# Altium project H2_receiver_v3.PrjPcb
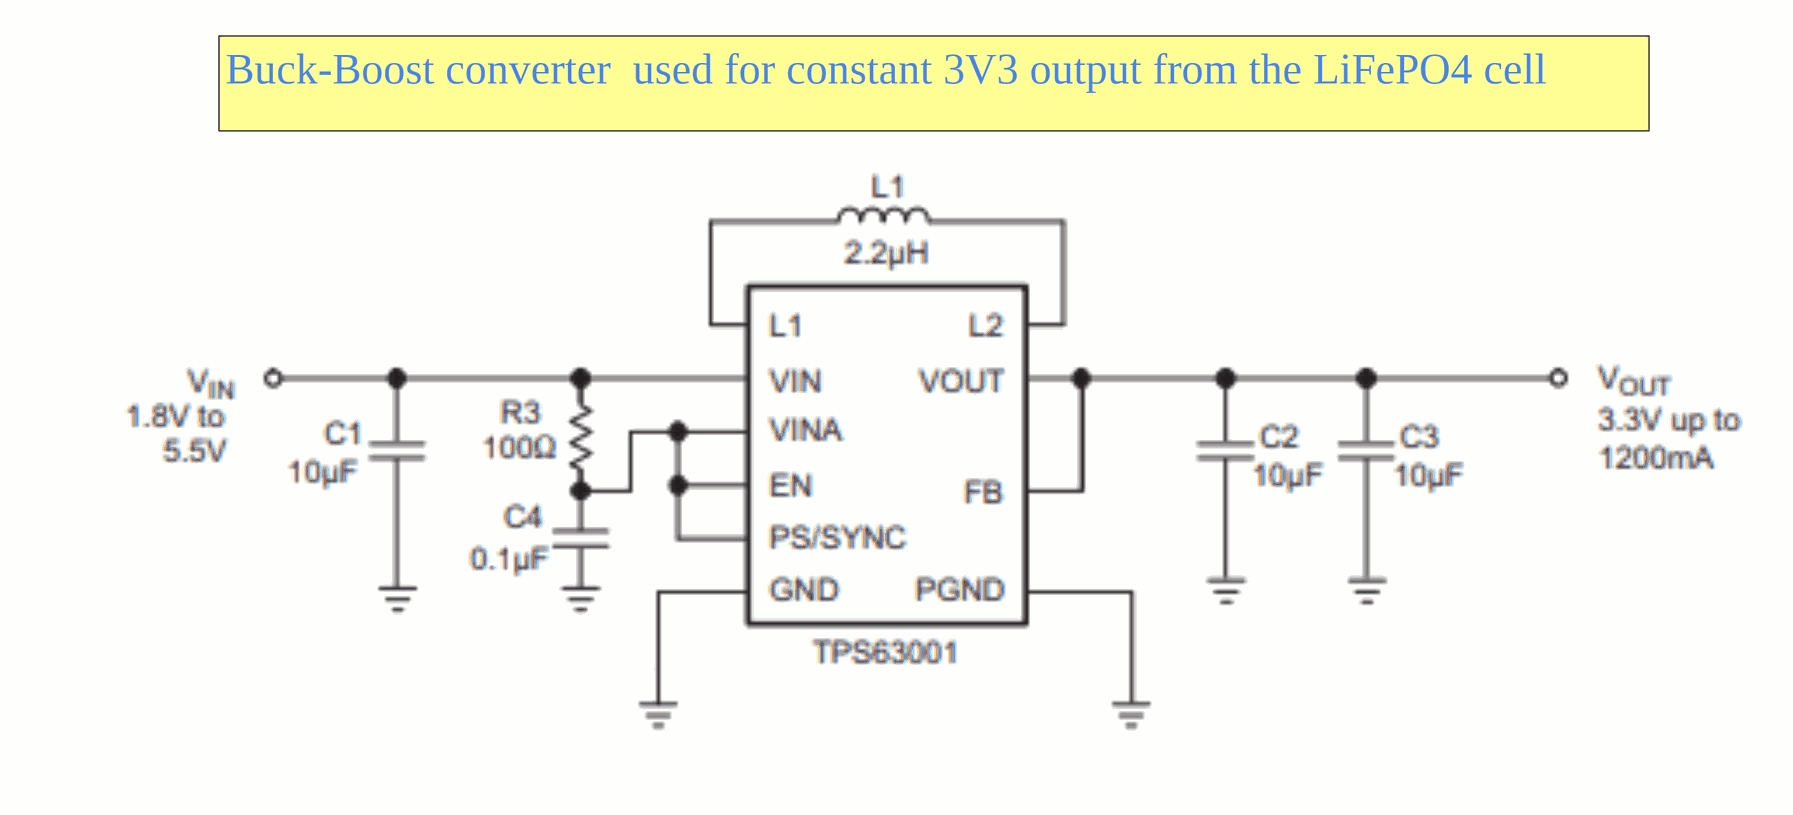
[diagram p0: 1_Power.SchDoc, top left]
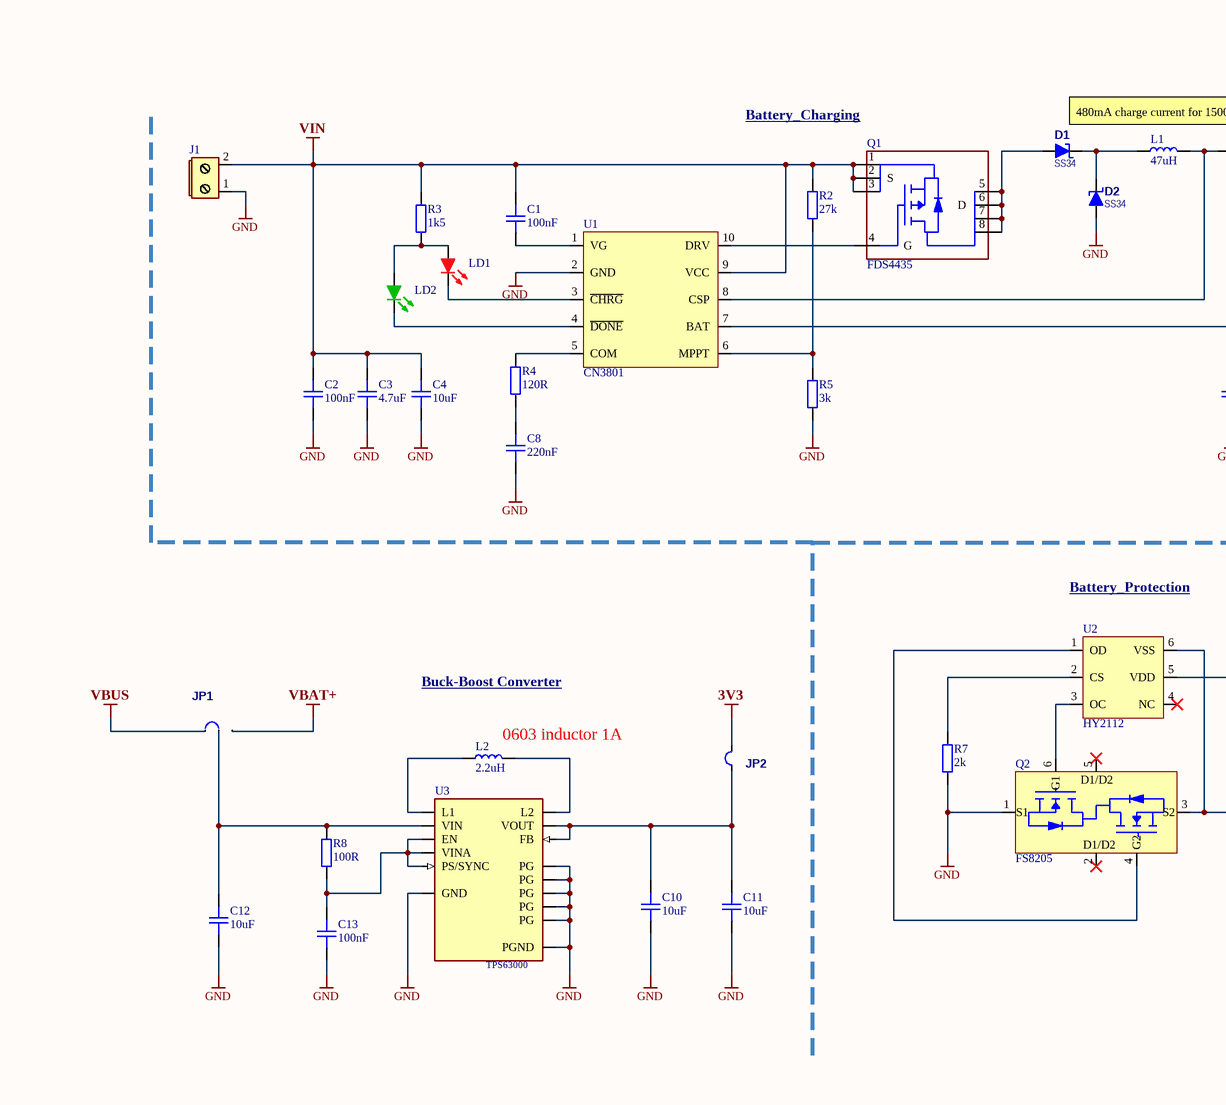
[diagram p1: 1_Power.SchDoc, top middle]
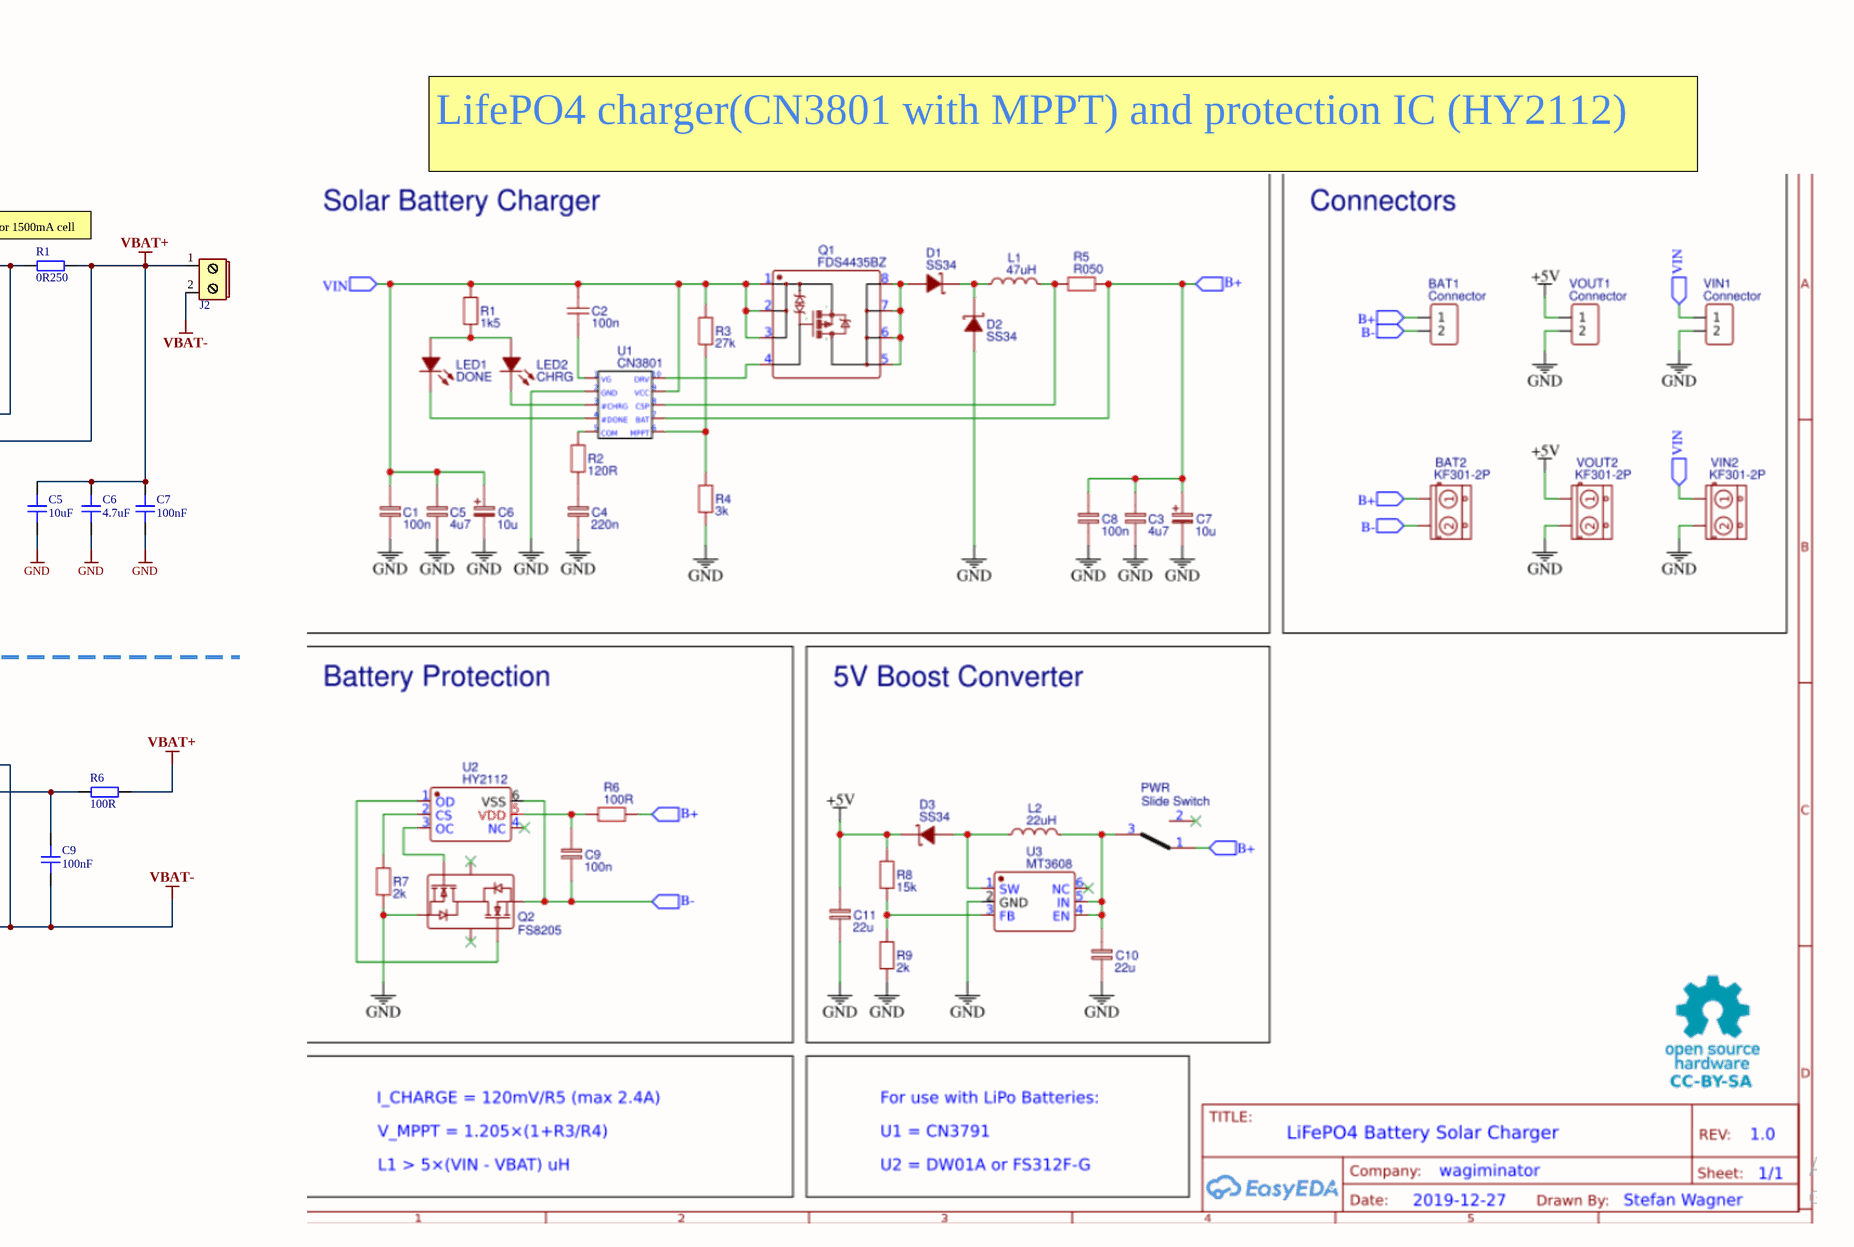
[diagram p2: 1_Power.SchDoc, top right]
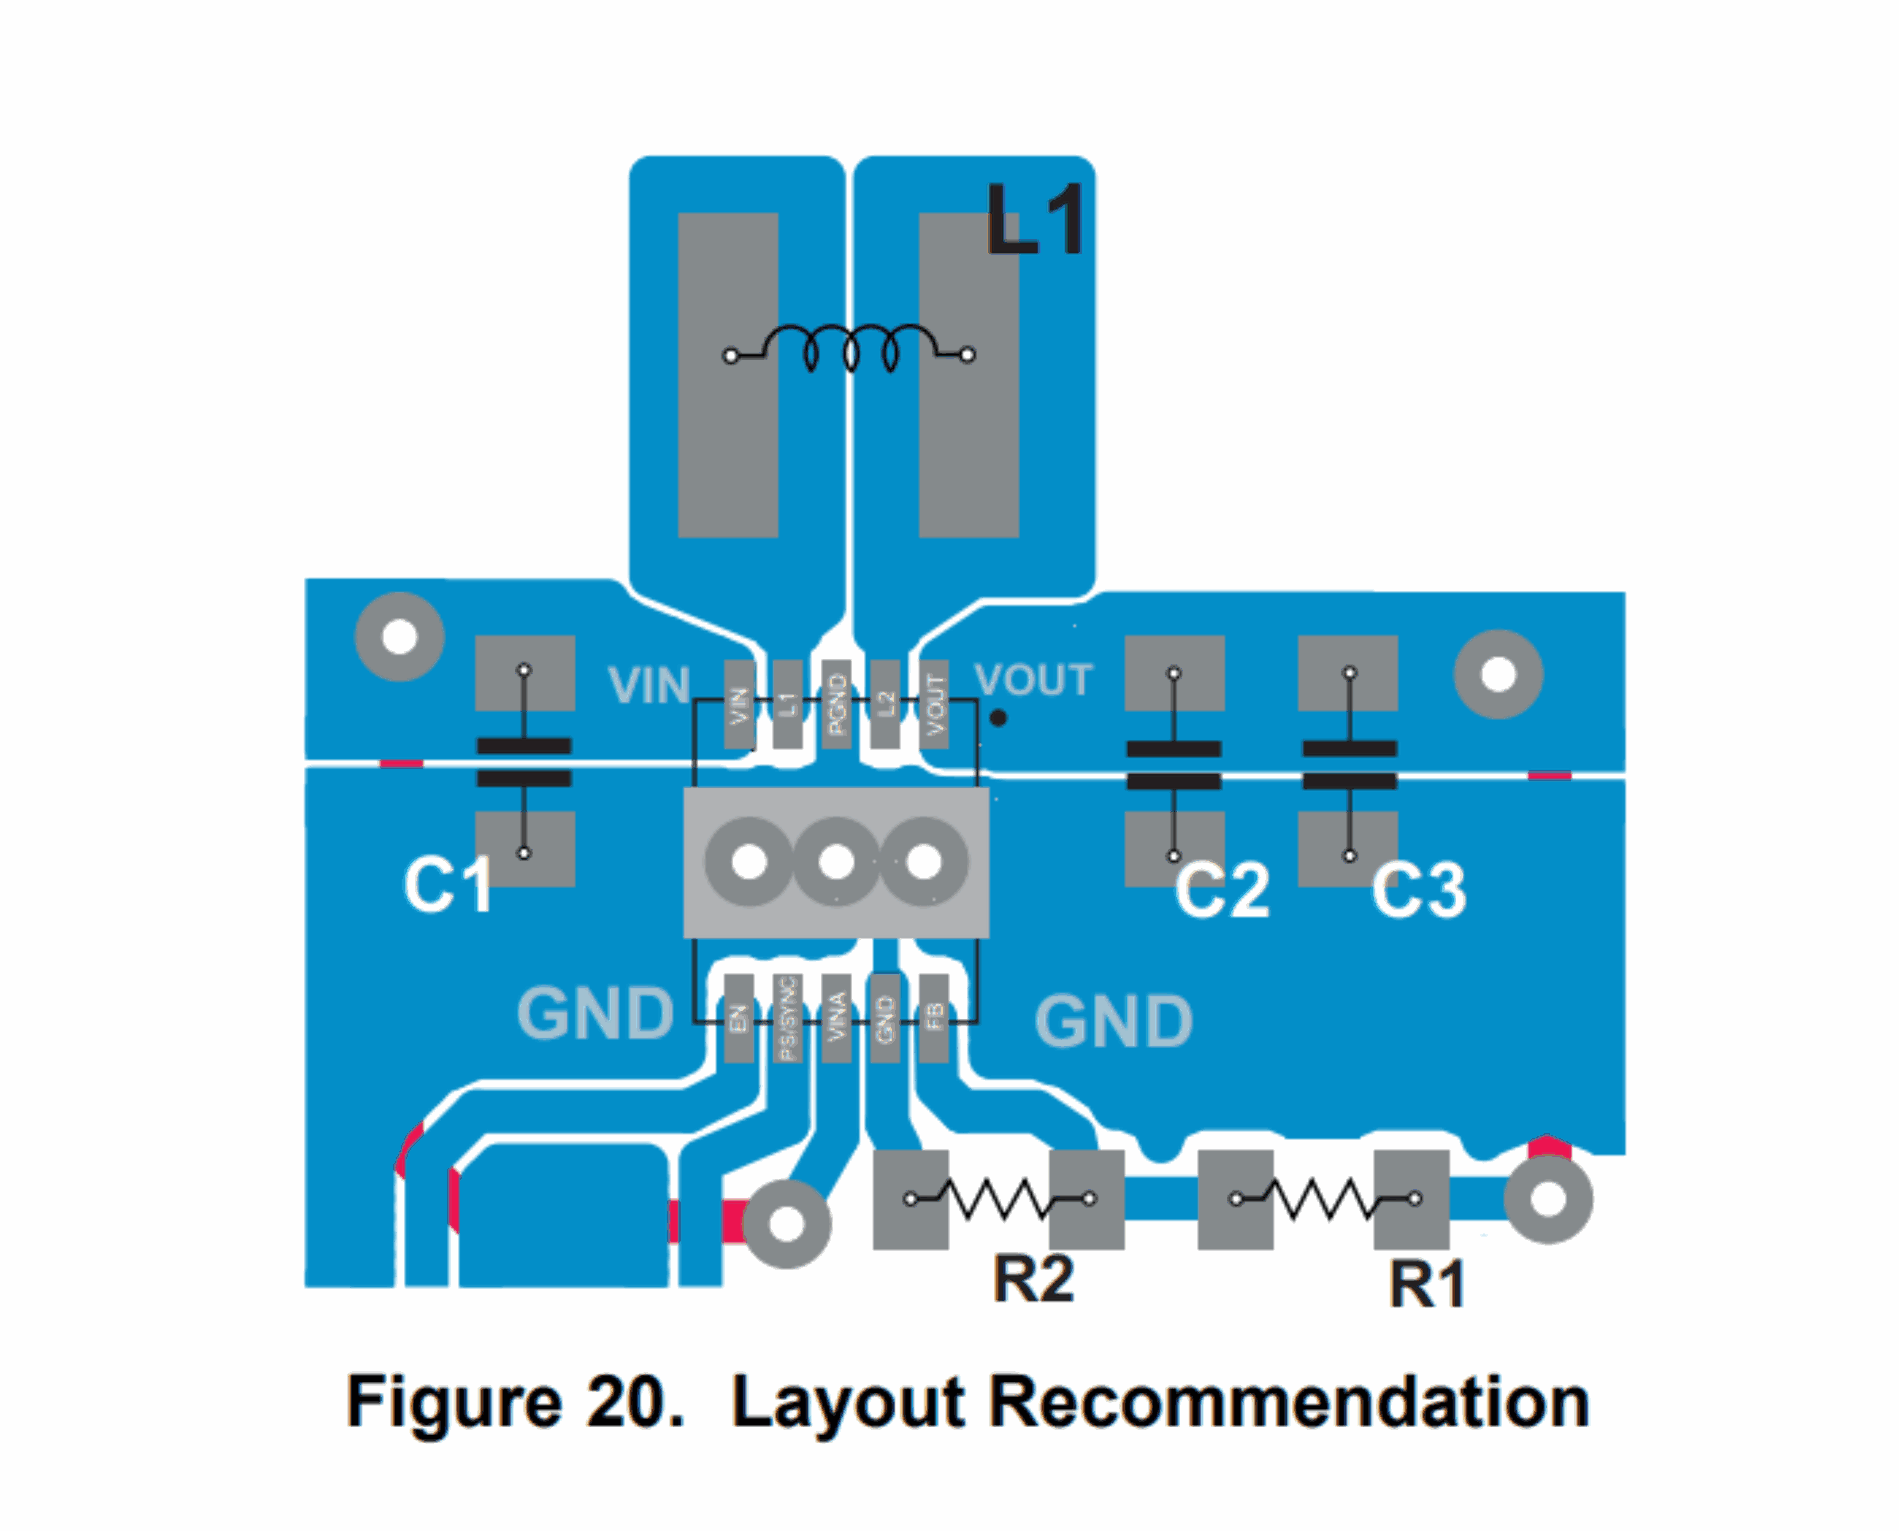
[diagram p3: 1_Power.SchDoc, bottom left]
4 sheets, 104 parts. Net scope: flat (ports and power ports of the same name join across sheets).
Board file: PCB1.PcbDoc
Sheets:
  1_Power.SchDoc
  2_Microcontroller.SchDoc
  3_Communication.SchDoc
  4_Display_NFC.SchDoc

## Sheet 1_Power.SchDoc: Power
size A4; DrawnBy: Cristian Oprea; Revision: 1; SheetNumber: 1; SheetTotal: 4

### Parts
C1  100nF  [C0603]
C2  100nF  [C0603]
C3  4.7uF  [C0603]
C4  10uF  [C0805]
C5  10uF  [C0805]
C6  4.7uF  [C0603]
C7  100nF  [C0603]
C8  220nF  [C0603]
C9  100nF  [C0603]
C10  10uF  [C0805]
C11  10uF  [C0805]
C12  10uF  [C0805]
C13  100nF  [C0603]
D1  SS34  [DO-214AC]
D2  SS34  [DO-214AC]
J1  PLUGIN_TERMINAL  [2.54_pluggable_terminal]  (value not drawn)
J2  PLUGIN_TERMINAL  [HEADER_1x2_2.54]  (value not drawn)
JP1  JUMPER_3PIN  [HEADER_1x3_2.54]  (value not drawn)
JP2  JUMPER  [HEADER_1x2_2.54]  (value not drawn)
L1  47uH  [IND_5_7]
L2  2.2uH  [L0603]
LD1  LED_RED  [LED0603RD]  (value not drawn)
LD2  LED_GREEN  [LED0603GR]  (value not drawn)
Q1  FDS4435  [SOIC-SN8_N]
Q2  FS8205  [SOT23-6]
R1  0R250  [R2512]
R2  27k  [R0603]
R3  1k5  [R0603]
R4  120R  [R0603]
R5  3k  [R0603]
R6  100R  [R0603]
R7  2k  [R0603]
R8  100R  [R0603]
U1  CN3801  [SSOP-10]
U2  HY2112  [SOT23-6]
U3  TPS63001  [VREG_V62/16624-01YE]  (value not drawn)

### Nets
3V3: JP2.2
GND: C2.1 C3.1 C4.1 C5.1 C6.1 C7.1 C8.1 C10.1 C11.1 C12.1 C13.1 D2.1(A) J1.1 Q2.1(S1) R5.1 R7.1 U1.2(GND) U3.3(PGND) U3.9(GND) U3.11(PG)
VBAT+: C5.2 C6.2 C7.2 J2.1 JP1.3 R1.2 R6.1 U1.7(BAT)
VBAT-: C9.1 J2.2 Q2.3(S2) U2.6(VSS)
VBUS: JP1.1
VIN: C1.2 C2.2 C3.2 C4.2 J1.2 Q1.1(S) Q1.2(S) Q1.3(S) R2.2 R3.2 U1.9(VCC)
NetC1_1: C1.1 U1.1(VG)
NetC8_2: C8.2 R4.1
NetC9_2: C9.2 R6.2 U2.5(VDD)
NetC10_2: C10.2 C11.2 JP2.1 U3.1(VOUT) U3.10(FB)
NetC12_2: C12.2 JP1.2 R8.2 U3.5(VIN)
NetC13_2: C13.2 R8.1 U3.6(EN) U3.7(PS/SYNC) U3.8(VINA)
NetD1_1: D1.1(A) Q1.5(D) Q1.6(D) Q1.7(D) Q1.8(D)
NetD1_2: D1.2(K) D2.2(K) L1.1
NetL1_2: L1.2 R1.1 U1.8(CSP)
NetL2_1: L2.1 U3.4(L1)
NetL2_2: L2.2 U3.2(L2)
NetLD1_1: LD1.1(A) LD2.1(A) R3.1
NetLD1_2: LD1.2(K) U1.3(~{CHRG})
NetLD2_2: LD2.2(K) U1.4(~{DONE})
NetQ1_4: Q1.4(G) U1.10(DRV)
NetQ2_4: Q2.4(G2) U2.1(OD)
NetQ2_6: Q2.6(G1) U2.3(OC)
NetR2_1: R2.1 R5.2 U1.6(MPPT)
NetR4_2: R4.2 U1.5(COM)
NetR7_2: R7.2 U2.2(CS)

Not connected (* = marked no-connect by the designer): Q2 2(D1/D2)* 5(D1/D2)*; U2 4(NC)*

### Notes on the sheet
- Buck-Boost converter  used for constant 3V3 output from the LiFePO4 cell
- LifePO4 charger(CN3801 with MPPT) and protection IC (HY2112)
- Battery_Charging
- 480mA charge current for 1500mA cell
- Switching between VBUS and Battery Power for debugging
- Battery_Protection
- Overcharge, Overdischarge, Overcurrent, Short-circuit protection
- Buck-Boost Converter
- 3V3 could be interrupted for testing or current measurement
- (near L2) 0603 inductor 1A

### Library data of the parts
C1-C3 C6-C9 C13 = CAP_0603: Capacitor SMD 0603; Manufacturer: *; Manufacturer Part Number: *; Distributor Link: *; LCSC: *; Rating: *; Dielectric: *
C4 C5 C10-C12 = CAP_0805: Capacitor SMD 0805; Manufacturer: *; Manufacturer Part Number: *; Distributor Link: *; LCSC: *; Rating: *; Dielectric: *
D1 D2 = DIODE_SCHOTTKY: Diode; Manufacturer Part Number 1: *; PackageReference: *
J1 J2 = Power_Connector: Screw terminal or plug terminal for power
JP1 = JUMPER_3PIN: *; PackageReference: *; Manufacturer Part Number 1: *
JP2 = JUMPER: *; PackageReference: *; Manufacturer Part Number 1: *
L1 = IND_0603: Inductor SMD 0603
L2 = IND_1008: Inductor SMD 1008
LD1 = LED_RED: Typical BLUE SiC LED; Published: 8-Jun-2000; LatestRevisionDate: 17-Dec-2003; LatestRevisionNote: PCB Footprint replaced.; DatasheetVersion: 16-Apr-2002; PackageVersion: 16-Apr-2002; Publisher: Altium Limited; PackageDescription: SM LED; 2 C-Bend Leads; Body 3.5 x 2.8 x 1.9 mm, inc leads (LxWxH typ); Manufacturer Part Number 1: *; PackageReference: 3.5X2.8X1.9
LD2 = LED_GREEN: Typical BLUE SiC LED; Published: 8-Jun-2000; LatestRevisionDate: 17-Dec-2003; LatestRevisionNote: PCB Footprint replaced.; DatasheetVersion: 16-Apr-2002; PackageVersion: 16-Apr-2002; Publisher: Altium Limited; PackageDescription: SM LED; 2 C-Bend Leads; Body 3.5 x 2.8 x 1.9 mm, inc leads (LxWxH typ); Manufacturer Part Number 1: *; PackageReference: 3.5X2.8X1.9
R1 = RES_0805: Resistor SMD 0805; Manufacturer: *; Manufacturer Part Number: *; Distributor Link: *; LCSC: *
R2-R6 R8 = RES_0603: Resistor SMD 0603; Manufacturer: *; Manufacturer Part Number: *; Distributor Link: *; LCSC: *
R7 = RES_0603_1: Resistor SMD 0603; Manufacturer: *; Manufacturer Part Number: *; Distributor Link: *; LCSC: *
U1 = CN3801: LiFePO4 charge IC with integrated MPPT and wide input range (4.5 to 28V) with deeply discharged cell revive
U2 = HY2112: LiFePO4 protection IC
U3 = TPS63000: Buck-Boost Switching Regulator IC Positive Adjustable 1.2V 1 Output 1.6A _Switch_ 10-VFDFN Exposed Pad; MF: Texas Instruments; Package: QFN-10 Texas Instruments; SnapEDA_Link: https://www.snapeda.com/parts/TPS63000/Texas%20Instruments/view-part/572521/?ref=snap; MP: TPS63000; Value: *; Availability: Unavailable; Price: None

## Sheet 2_Microcontroller.SchDoc: Microcontroller
size A4; DrawnBy: Cristian Oprea; Revision: 1; SheetNumber: 2; SheetTotal: 4
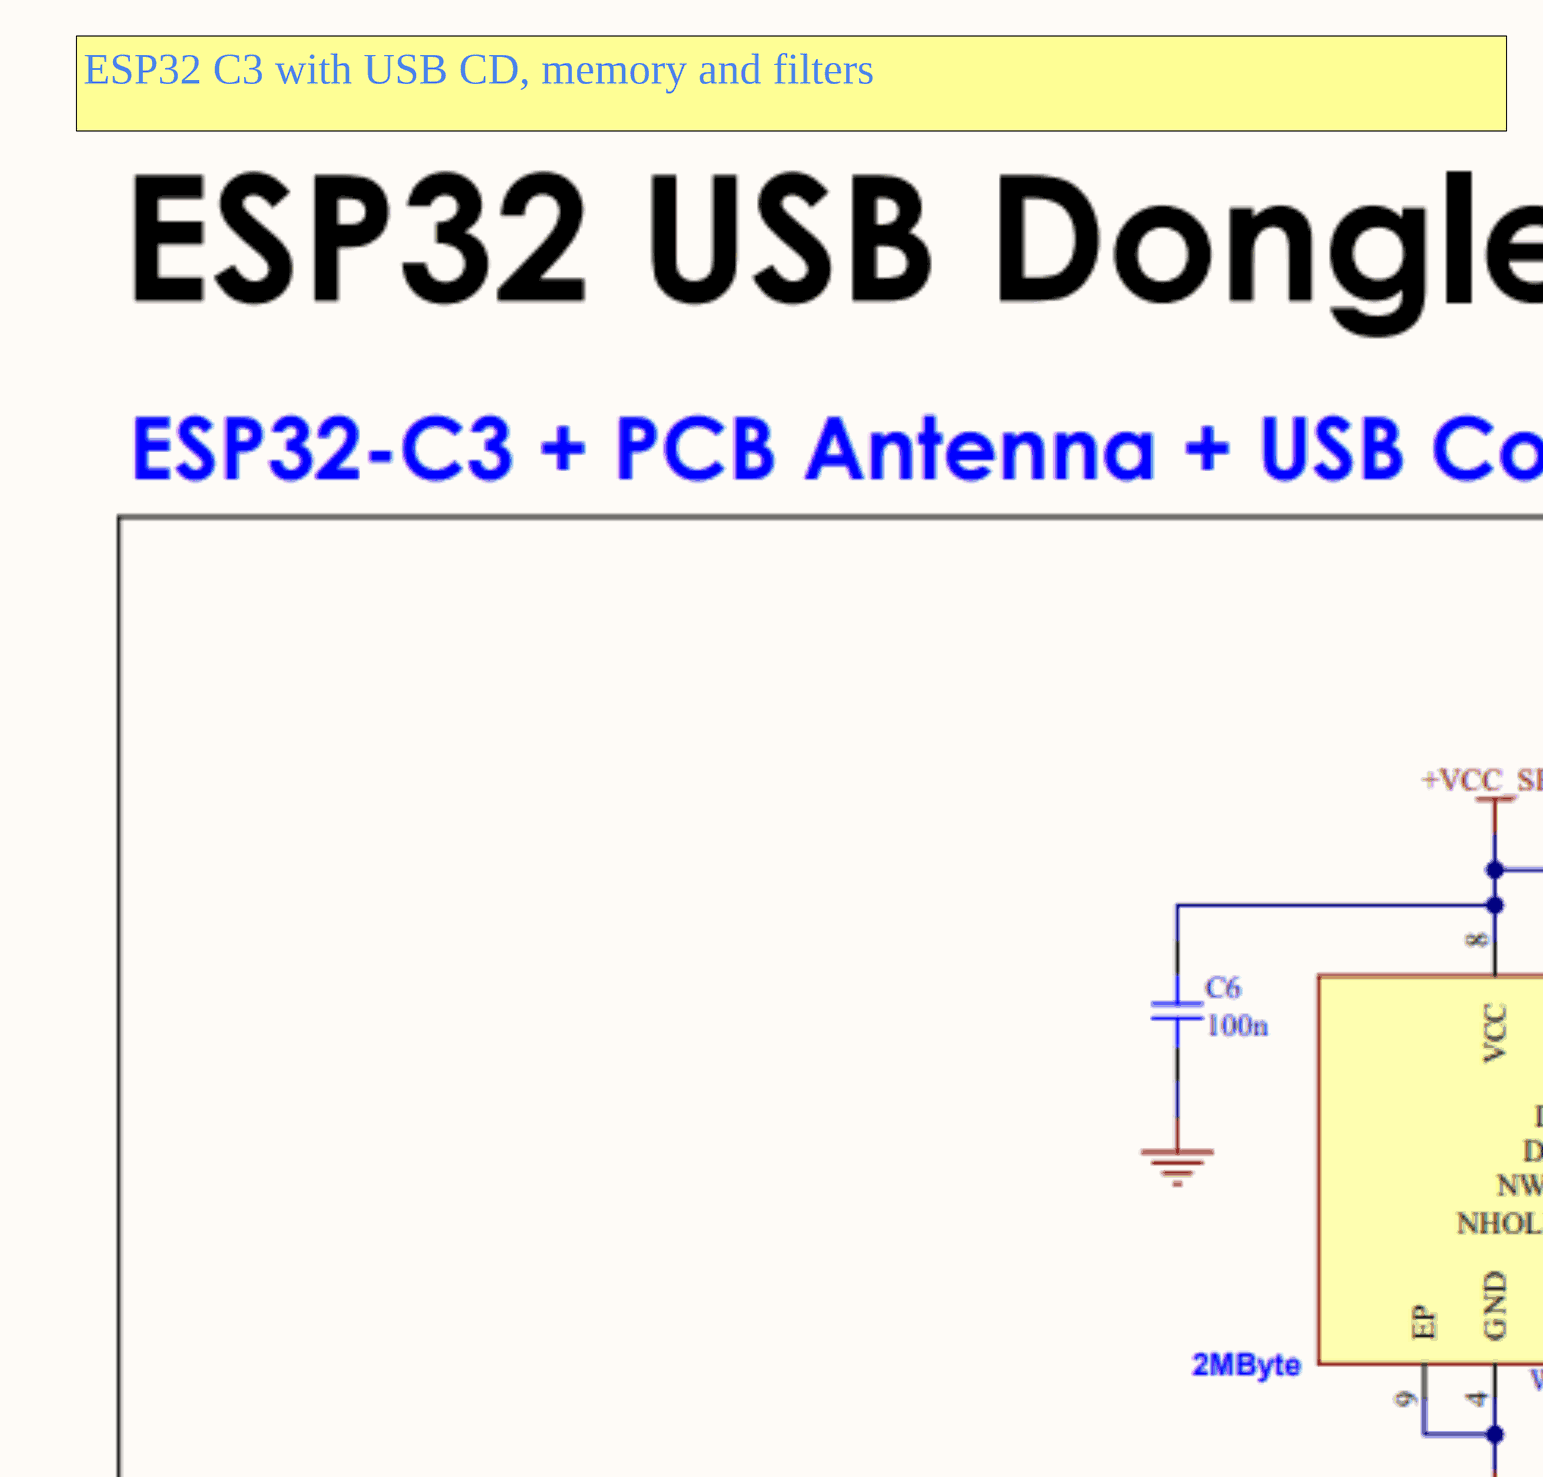
[diagram p4: 2_Microcontroller.SchDoc, top right]
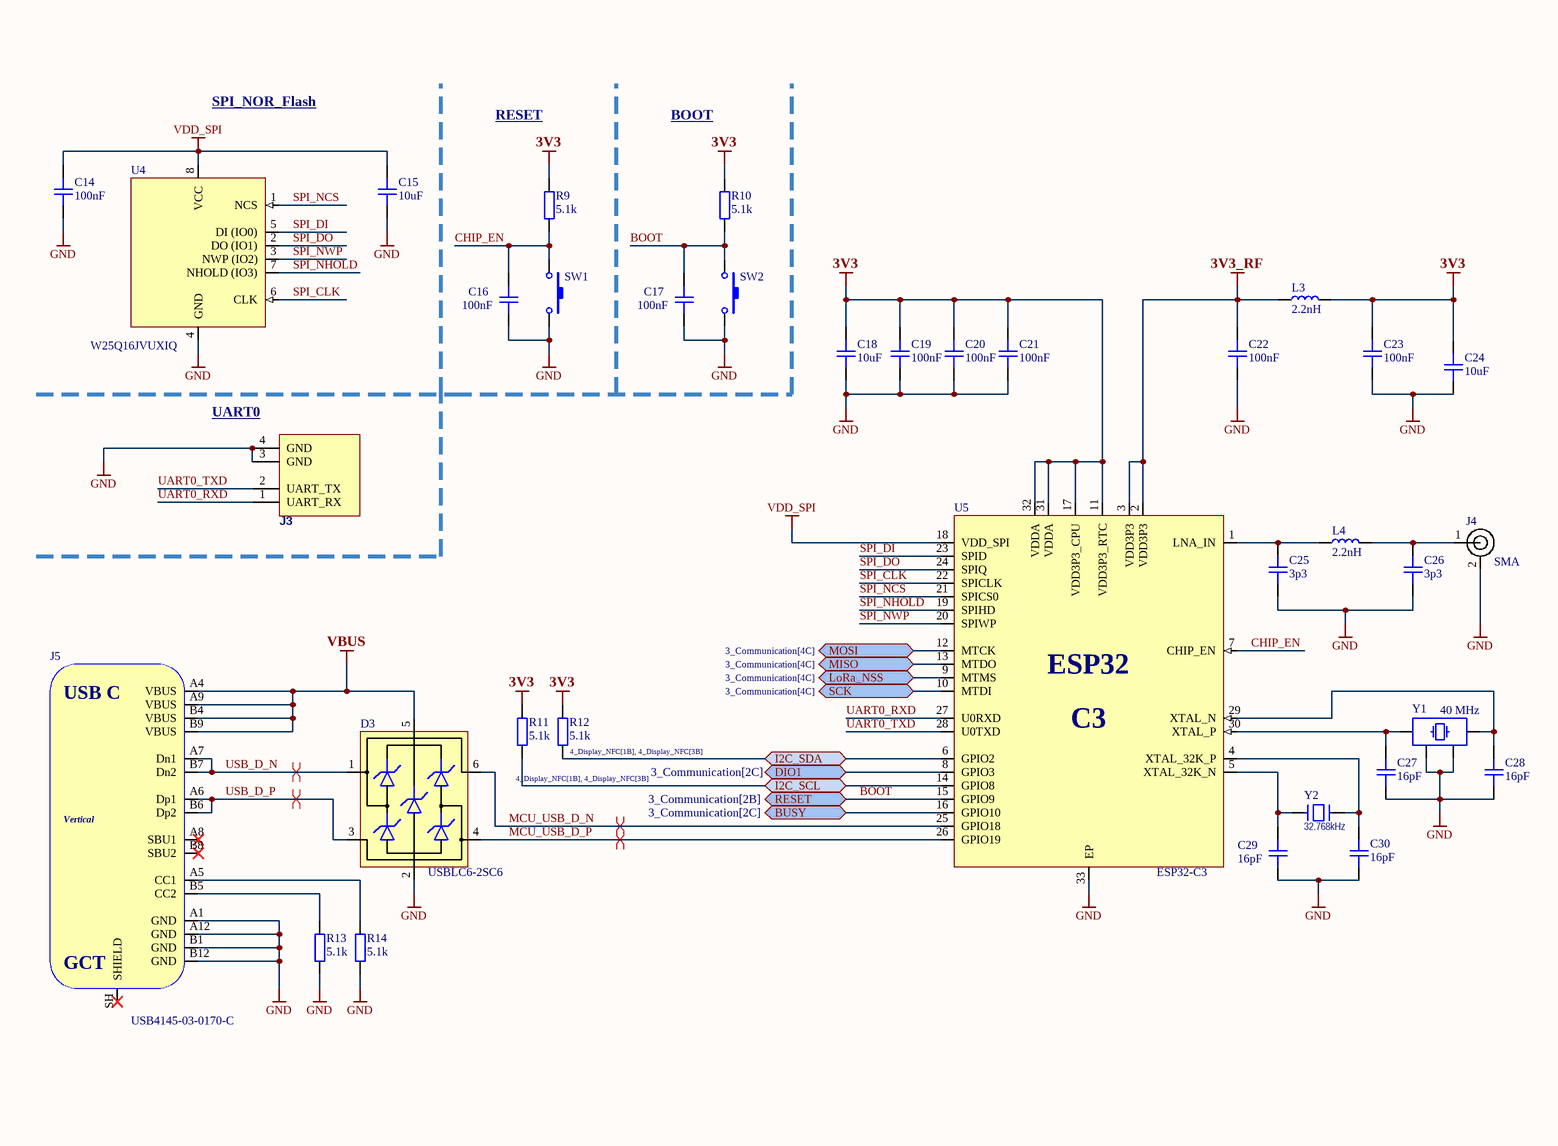
[diagram p5: 2_Microcontroller.SchDoc, bottom left]
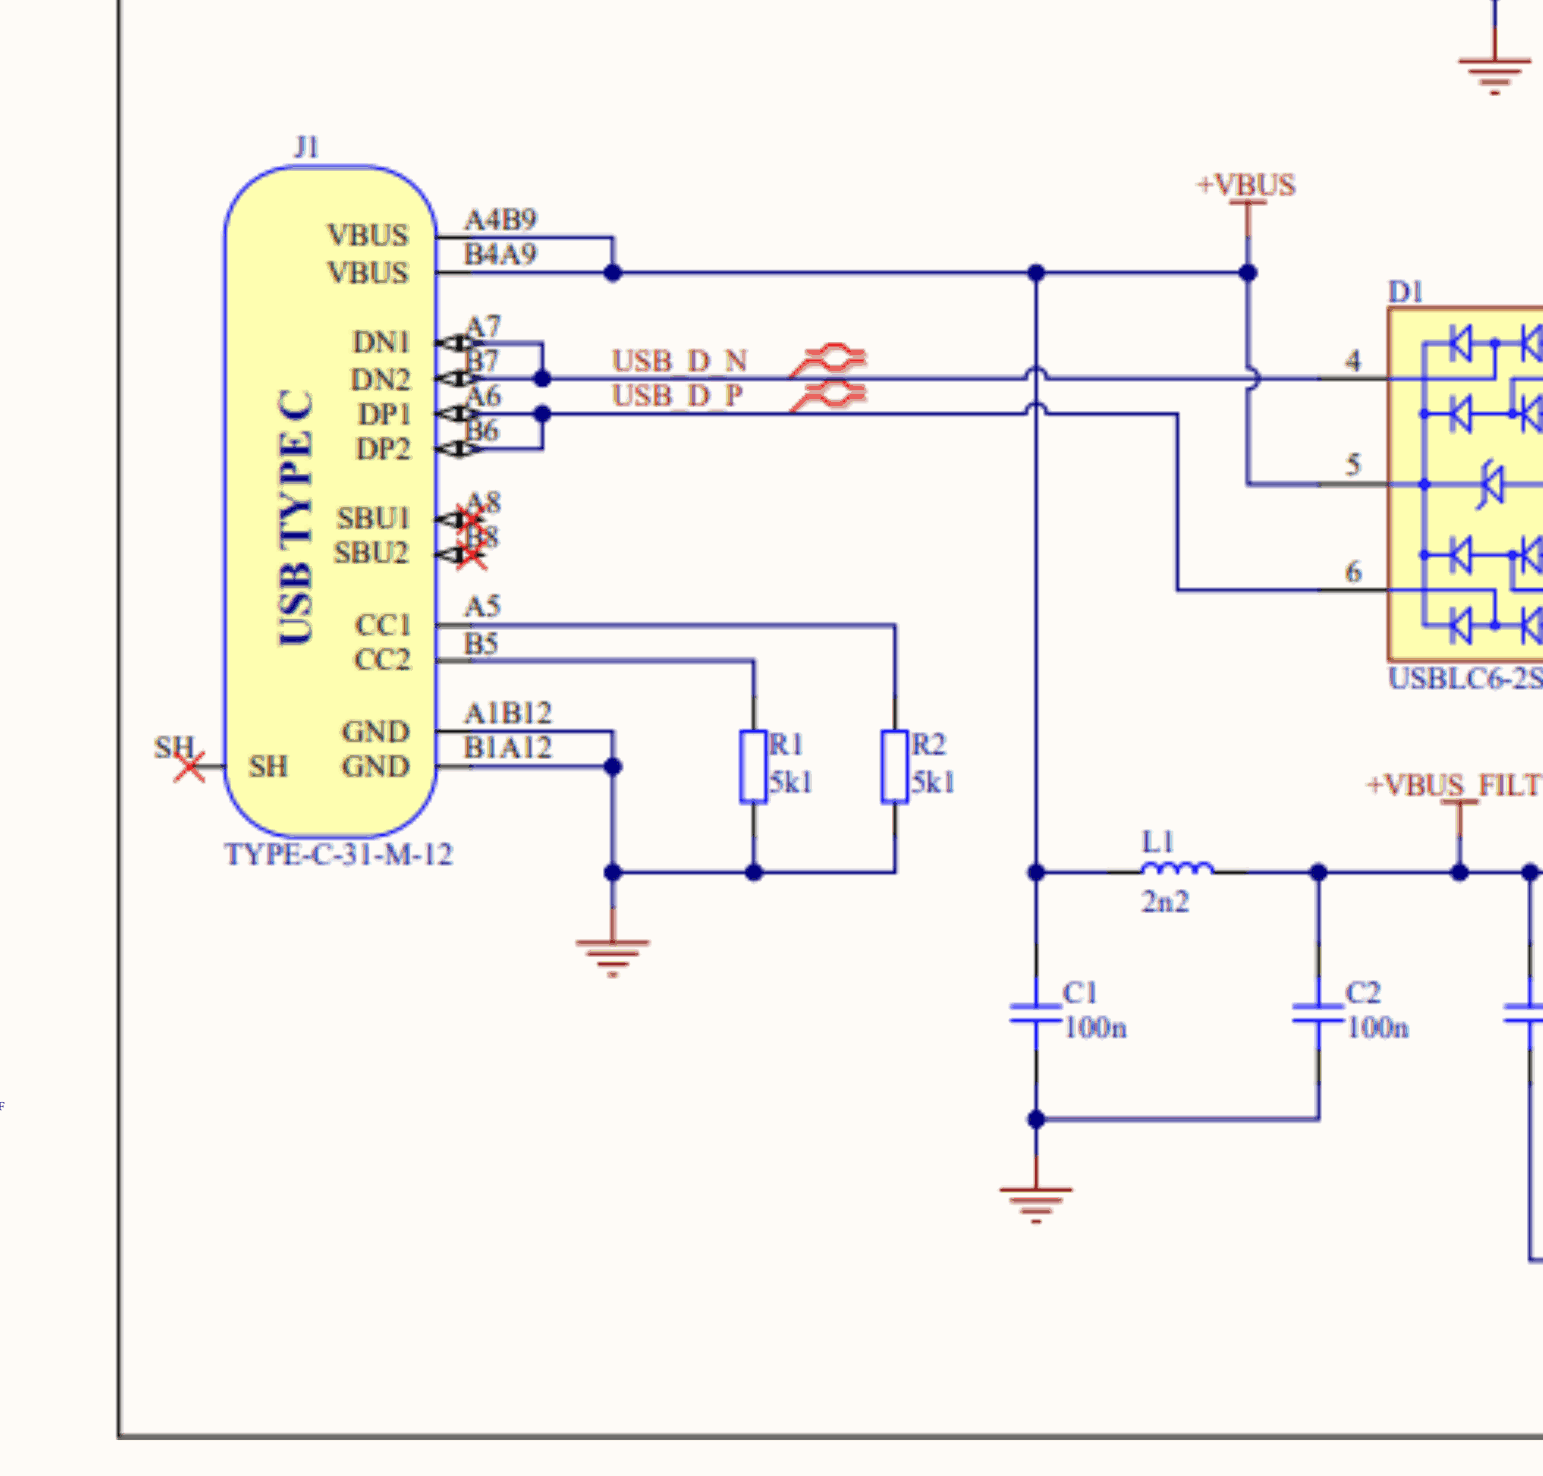
[diagram p6: 2_Microcontroller.SchDoc, bottom right]

### Parts
C14  100nF  [C0603]
C15  10uF  [C0805]
C16  100nF  [C0603]
C17  100nF  [C0603]
C18  10uF  [C0805]
C19  100nF  [C0603]
C20  100nF  [C0603]
C21  100nF  [C0603]
C22  100nF  [C0603]
C23  100nF  [C0603]
C24  10uF  [C0805]
C25  3p3  [C0603]
C26  3p3  [C0603]
C27  16pF  [C0603]
C28  16pF  [C0603]
C29  16pF  [C0603]
C30  16pF  [C0603]
D3  USBLC6-2SC6  [SOT23-6]
J3  Header1x4  [HEADER_2x2_2.54]  (value not drawn)
J4  SMA  [CON_SMA-EDGE-S]
J5  USB4145-03-0170-C  [VALCON_CSP-USC16-TR]
L3  2.2nH  [L0603]
L4  2.2nH  [L0603]
R9  5.1k  [R0603]
R10  5.1k  [R0603]
R11  5.1k  [R0603]
R12  5.1k  [R0603]
R13  5.1k  [R0603]
R14  5.1k  [R0603]
SW1  PTS645SM43SMTR92 LFS  [SW_SKRPACE010]  (value not drawn)
SW2  PTS645SM43SMTR92 LFS  [SW_SKRPACE010]  (value not drawn)
U4  W25Q16JVUXIQ  [SOIC-8N_208mil]
U5  ESP32-C3  [QFN-32-5x5x0.85mm]
Y1  40 MHz  [CRYSTAL_ECX-32_3.2x2.5x0.8 - duplicate]
Y2  32.768kHz  [CRYSTAL_SX-3215]

### Ports
BUSY (bidir, see 3_Communication[2C]), DIO1 (bidir, see 3_Communication[2C]), I2C_SCL (bidir, see 4_Display_NFC[1B], 4_Display_NFC[3B]), I2C_SDA (bidir, see 4_Display_NFC[1B], 4_Display_NFC[3B]), LoRa_NSS (bidir, see 3_Communication[4C]), MISO (bidir, see 3_Communication[4C]), MOSI (bidir, see 3_Communication[4C]), RESET (bidir, see 3_Communication[2B]), SCK (bidir, see 3_Communication[4C])

### Nets
3V3: C18.2 C19.2 C20.2 C21.2 C23.2 C24.2 L3.2 R9.2 R10.2 R11.2 R12.2 U5.11(VDD3P3_RTC) U5.17(VDD3P3_CPU) U5.31(VDDA) U5.32(VDDA)
3V3_RF: C22.2 L3.1 U5.2(VDD3P3) U5.3(VDD3P3)
GND: C14.1 C15.1 C16.1 C17.1 C18.1 C19.1 C20.1 C21.1 C22.1 C23.1 C24.1 C25.1 C26.1 C27.1 C28.1 C29.1 C30.1 D3.2(GND) J3.3(GND) J3.4(GND) J4.2 J5.A1(GND) J5.A12(GND) J5.B1(GND) J5.B12(GND) R13.1 R14.1 SW1.2 SW2.2 U4.4(GND) U5.33(EP) Y1.2 Y1.4
VBUS: D3.5(VBUS) J5.A4(VBUS) J5.A9(VBUS) J5.B4(VBUS) J5.B9(VBUS)
VDD_SPI: C14.2 C15.2 U4.8(VCC) U5.18(VDD_SPI)
BOOT: C17.2 R10.1 SW2.1 U5.15(GPIO9) ; port RESET
CHIP_EN: C16.2 R9.1 SW1.1 U5.7(CHIP_EN)
LoRa_BUSY: U5.16(GPIO10) ; port BUSY
LoRa_DIO1: U5.8(GPIO3) ; port DIO1
LoRa_NSS: U5.9(MTMS) ; port LoRa_NSS
MCU_USB_D_N: D3.6(IO1) U5.25(GPIO18)
MCU_USB_D_P: D3.4(IO2) U5.26(GPIO19)
MISO: U5.13(MTDO) ; port MISO
MOSI: U5.12(MTCK) ; port MOSI
SCK: U5.10(MTDI) ; port SCK
SCL: R11.1 U5.14(GPIO8) ; port I2C_SCL
SDA: R12.1 U5.6(GPIO2) ; port I2C_SDA
SPI_CLK: U4.6(CLK) U5.22(SPICLK)
SPI_DI: U4.5(DI_(IO0)) U5.23(SPID)
SPI_DO: U4.2(DO_(IO1)) U5.24(SPIQ)
SPI_NCS: U4.1(NCS) U5.21(SPICS0)
SPI_NHOLD: U4.7(NHOLD_(IO3)) U5.19(SPIHD)
SPI_NWP: U4.3(NWP_(IO2)) U5.20(SPIWP)
UART0_RXD: J3.1(UART_RX) U5.27(U0RXD)
UART0_TXD: J3.2(UART_TX) U5.28(U0TXD)
USB_D_N: D3.1(IO1) J5.A7(Dn1) J5.B7(Dn2)
USB_D_P: D3.3(IO2) J5.A6(Dp1) J5.B6(Dp2)
NetC25_2: C25.2 L4.1 U5.1(LNA_IN)
NetC26_2: C26.2 J4.1 L4.2
NetC27_2: C27.2 U5.30(XTAL_P) Y1.1
NetC28_2: C28.2 U5.29(XTAL_N) Y1.3
NetC29_2: C29.2 U5.5(XTAL_32K_N) Y2.2
NetC30_2: C30.2 U5.4(XTAL_32K_P) Y2.1
NetJ5_A5: J5.A5(CC1) R14.2
NetJ5_B5: J5.B5(CC2) R13.2

Not connected (* = marked no-connect by the designer): J5 A8(SBU1)* B8(SBU2)* SH(SHIELD)*

### Layout directives
differential pair: MCU_USB_D_N, MCU_USB_D_P, USB_D_N, USB_D_P

### Notes on the sheet
- ESP32 C3 with USB CD, memory and filters
- SPI_NOR_Flash
- RESET
- BOOT
- (near J3) UART0
- can be used for debug/programming
- (in symbol ESP32-C3) ESP32; C3
- (in symbol USB4145-03-0170-C) USB C; Vertical

### Library data of the parts
C14 C16 C17 C19-C23 C25-C30 = CAP_0603: Capacitor SMD 0603; Manufacturer: *; Manufacturer Part Number: *; Distributor Link: *; LCSC: *; Rating: *; Dielectric: *
C15 C18 C24 = CAP_0805: Capacitor SMD 0805; Manufacturer: *; Manufacturer Part Number: *; Distributor Link: *; LCSC: *; Rating: *; Dielectric: *
D3 = USBLC6-2SC6: Low-Capacitance ESD Protection USB; Manufacturer: STMicroelectronics; Manufacturer Part Number: USBLC6-2SC6; Distributor Link: https://www.mouser.de/ProductDetail/STMicroelectronics/USBLC6-2SC6?qs=po45yt2pPpu%2FhNIlwQdTlg%3D%3D
J3 = Header1x4: *; PackageReference: *; Manufacturer Part Number 1: *
J4 = CON-SMA-EDGE-S: RF Connector SMA Female 50 Ohms 18 GHz PCB Edge Mount; Manufacturer: RF Solutions; Manufacturer Part Number: CON-SMA-EDGE-S
J5 = USB4145-03-0170-C: USB Connector Type C SMT 16 Pin Vertical; Manufacturer: GCT; Manufacturer Part Number: USB4145-03-0170-C
L3 L4 = IND_1008: Inductor SMD 1008
R9-R14 = RES_0603: Resistor SMD 0603; Manufacturer: *; Manufacturer Part Number: *; Distributor Link: *; LCSC: *
SW1 SW2 = SW-PB: Switch; Published: 24-Mar-1999; LatestRevisionDate: 17-Jul-2002; LatestRevisionNote: Re-released for DXP Platform.; Publisher: Altium Limited; PackageDescription: Switch; 2 Leads; Manufacturer Part Number 1: PTS645SM43SMTR92 LFS; PackageReference: SW-PB
U4 = W25Q16JVUXIQ: 16M-BIT SERIAL FLASH MEMORY WITH DUAL/QUAD SPI USON-8; Manufacturer: Winbond; Manufacturer Part Number: W25Q16JVUXIQ; LCSC: C2843335
U5 = ESP32-C3: Ultra­Low­Power SoC with RISC­V Single­Core CPU Supporting IEEE 802.11b/g/n (2.4 GHz Wi­Fi) and Bluetooth® 5 (LE); Manufacturer: Espressif; Manufacturer Part Number: ESP32-C3; LCSC: C2838500
Y1 = XTAL_2016: Crystal SMD 4-Pin 3225x4; Distributor Link: *
Y2 = CRYSTAL_1: Crystal; Manufacturer Part Number 1: *; PackageReference: SX-3215

## Sheet 3_Communication.SchDoc: Communication
size A4; DrawnBy: Cristian Oprea; Revision: 1; SheetNumber: 3; SheetTotal: 4
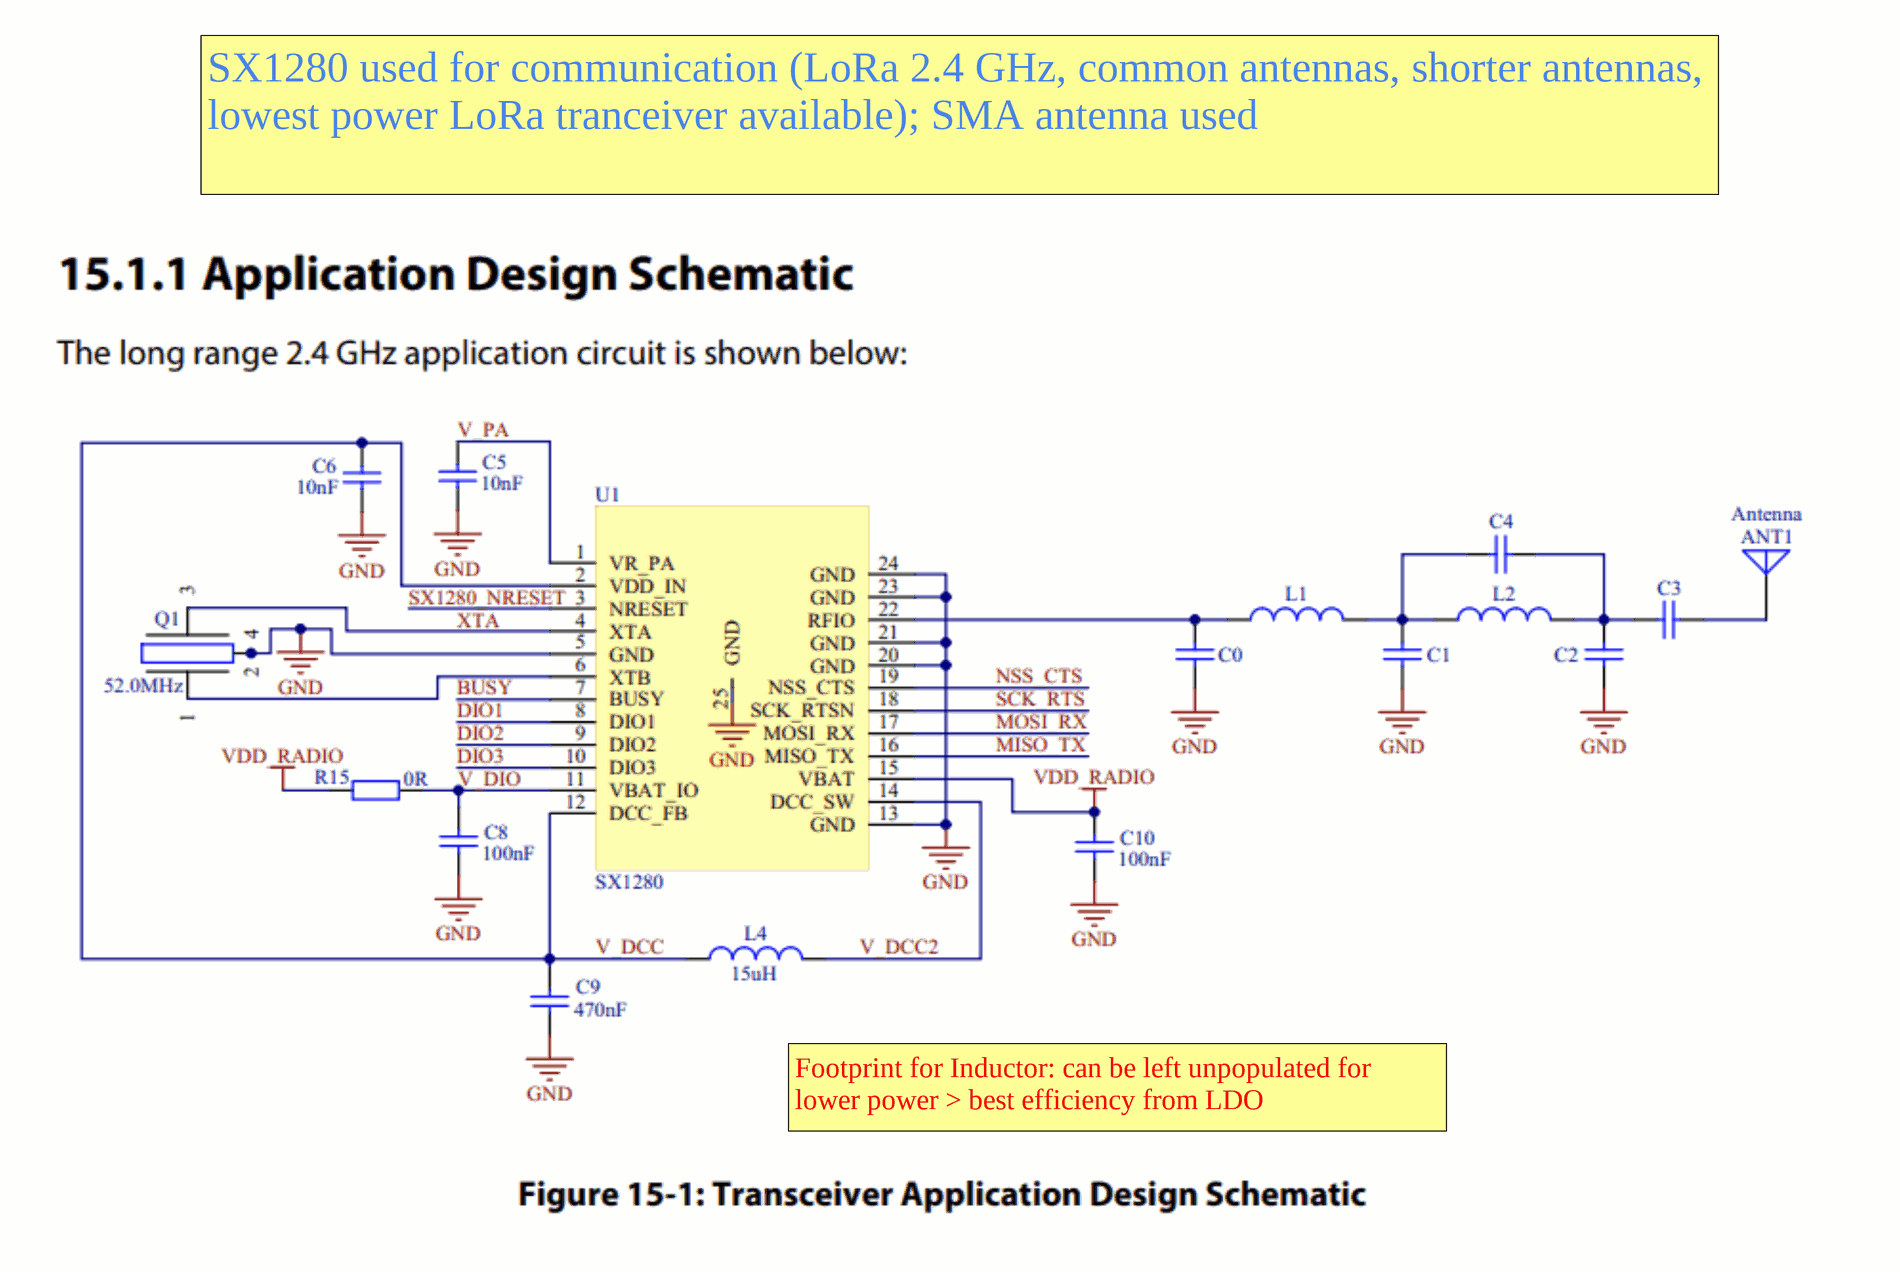
[diagram p7: 3_Communication.SchDoc, left]
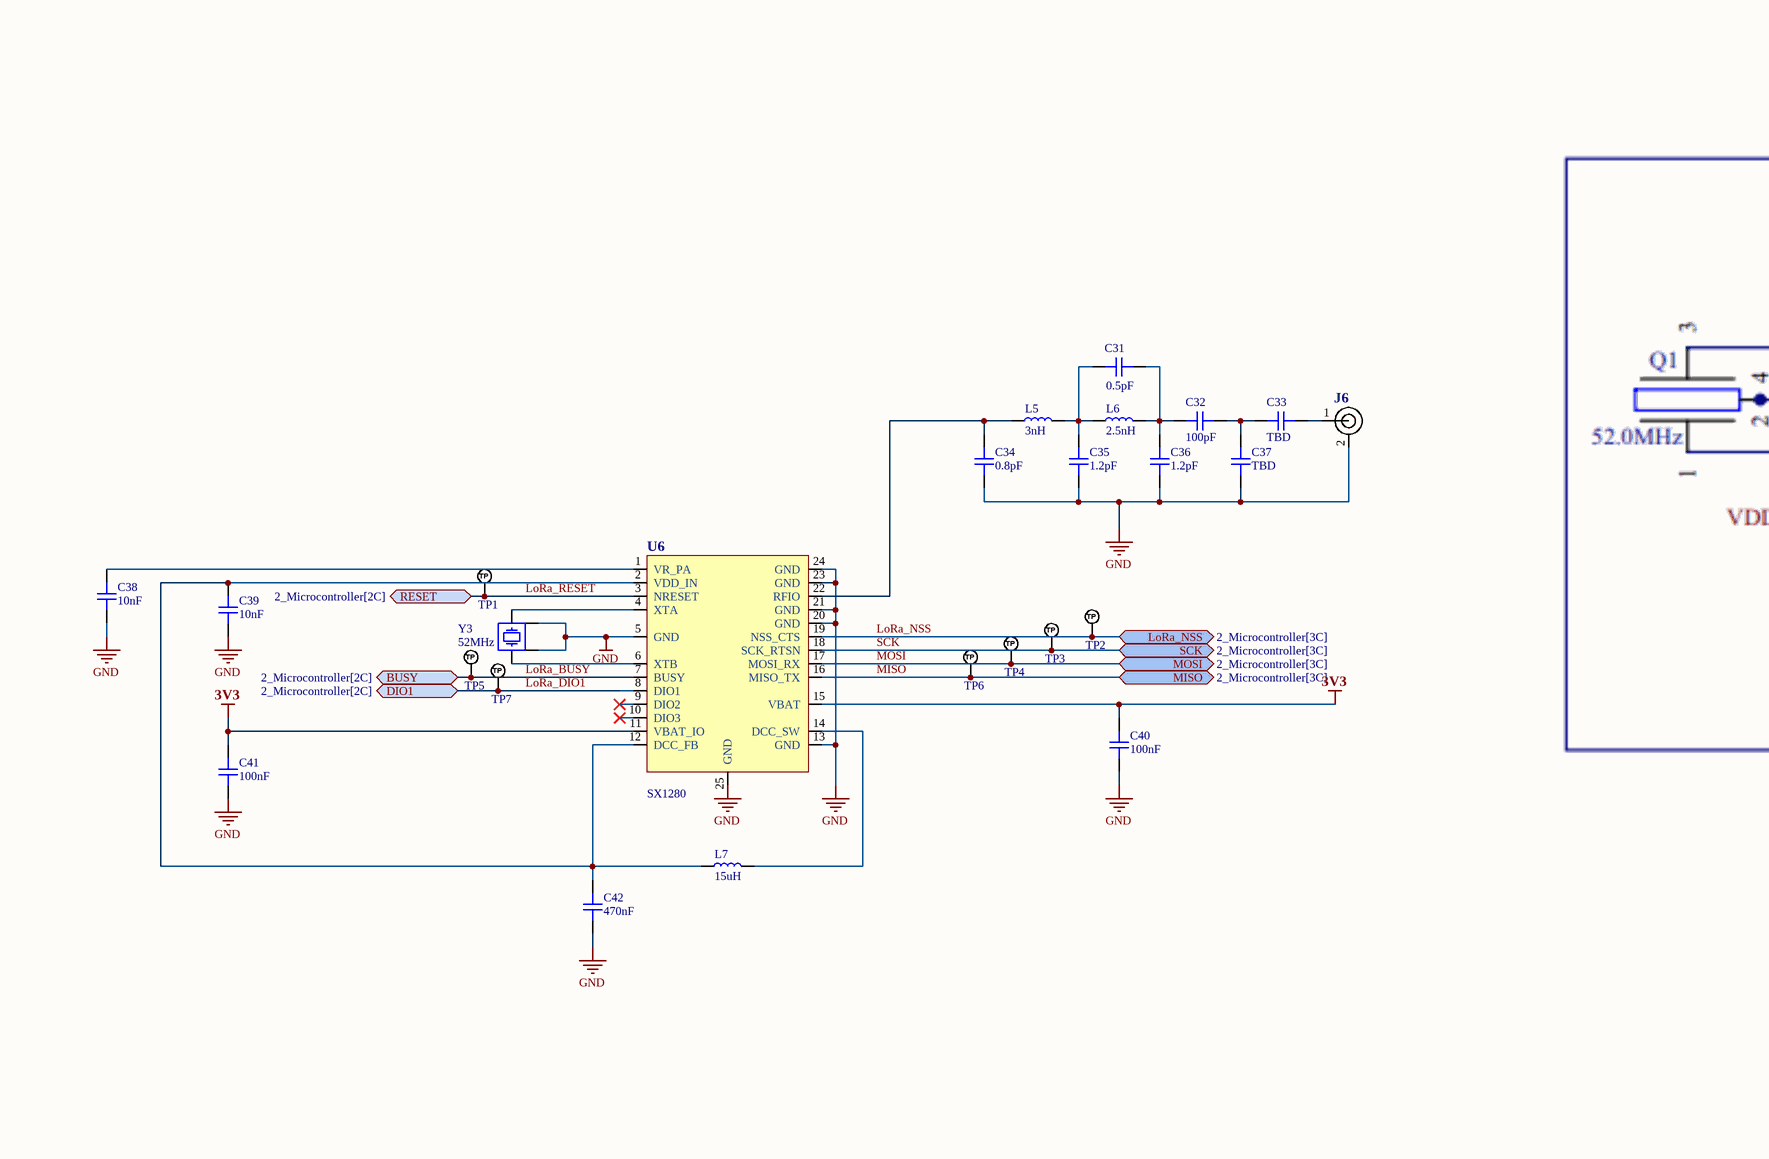
[diagram p8: 3_Communication.SchDoc, middle]
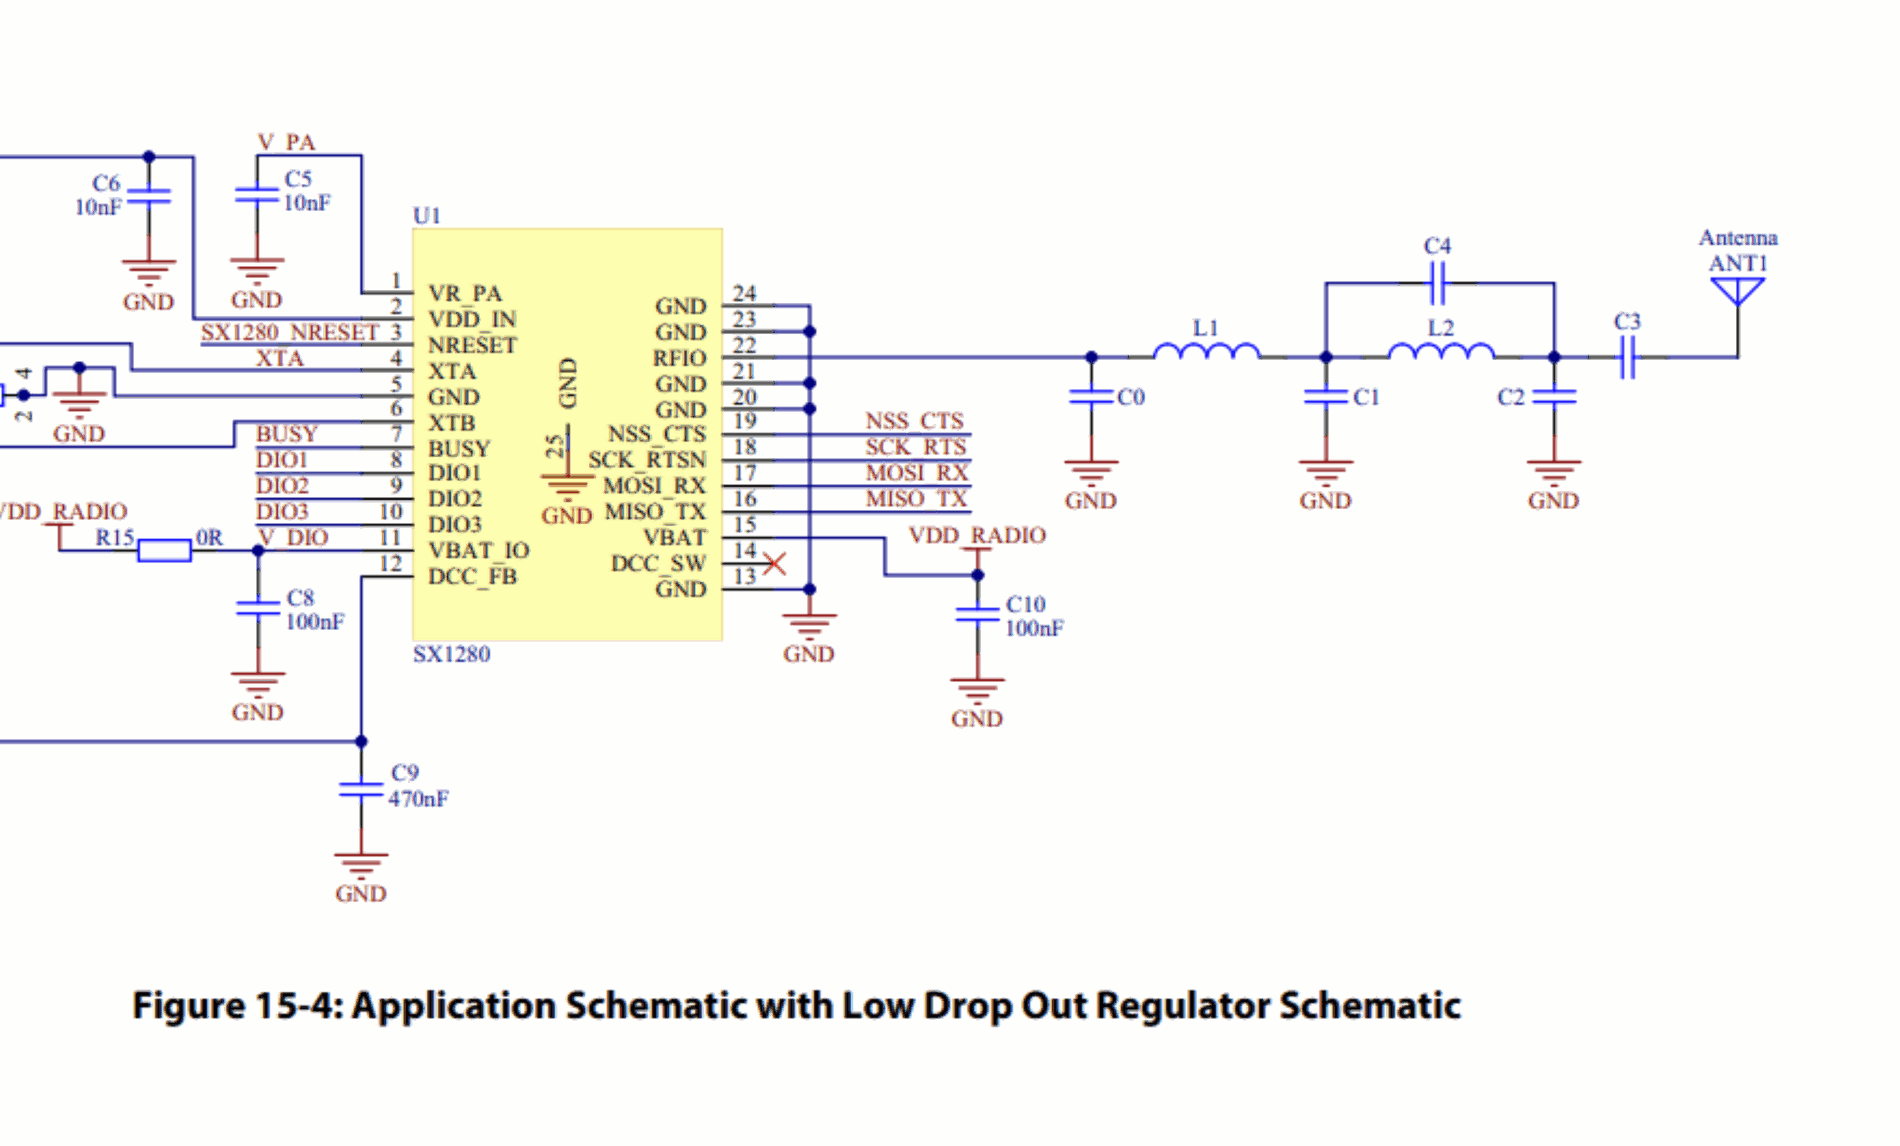
[diagram p9: 3_Communication.SchDoc, right]

### Parts
C31  0.5pF  [C0603]
C32  100pF  [C0603]
C33  TBD  [C0805]
C34  0.8pF  [C0603]
C35  1.2pF  [C0603]
C36  1.2pF  [C0603]
C37  TBD  [C0805]
C38  10nF  [C0603]
C39  10nF  [C0603]
C40  100nF  [C0603]
C41  100nF  [C0603]
C42  470nF  [C0603]
J6  SMA_EDGE_CONN  [CON_SMA-EDGE-S]  (value not drawn)
L5  3nH  [L0603]
L6  2.5nH  [L0603]
L7  15uH  [IND_3.2_4]
TP1  TP_NOBOM  [TEST_PAD_THD]  (value not drawn)  (no BOM)
TP2  TP_NOBOM  [TEST_PAD_THD]  (value not drawn)  (no BOM)
TP3  TP_NOBOM  [TEST_PAD_THD]  (value not drawn)  (no BOM)
TP4  TP_NOBOM  [TEST_PAD_THD]  (value not drawn)  (no BOM)
TP5  TP_NOBOM  [TEST_PAD_THD]  (value not drawn)  (no BOM)
TP6  TP_NOBOM  [TEST_PAD_THD]  (value not drawn)  (no BOM)
TP7  TP_NOBOM  [TEST_PAD_THD]  (value not drawn)  (no BOM)
U6  SX1280  [QFN-24_4x4_0.5]
Y3  52MHz  [CRYSTAL_2016_4P]

### Ports
BUSY (bidir, see 2_Microcontroller[2C]), DIO1 (bidir, see 2_Microcontroller[2C]), LoRa_NSS (bidir, see 2_Microcontroller[3C]), MISO (bidir, see 2_Microcontroller[3C]), MOSI (bidir, see 2_Microcontroller[3C]), RESET (bidir, see 2_Microcontroller[2C]), SCK (bidir, see 2_Microcontroller[3C])

### Nets
3V3: C40.2 C41.2 U6.11(VBAT_IO) U6.15(VBAT)
GND: C34.1 C35.1 C36.1 C37.1 C38.1 C39.1 C40.1 C41.1 C42.1 J6.2 U6.5(GND) U6.13(GND) U6.20(GND) U6.21(GND) U6.23(GND) U6.24(GND) U6.25(GND) Y3.2 Y3.4
LoRa_BUSY: TP5.1(TP) U6.7(BUSY) ; port BUSY
LoRa_DIO1: TP7.1(TP) U6.8(DIO1) ; port DIO1
LoRa_NSS: TP2.1(TP) U6.19(NSS_CTS) ; port LoRa_NSS
LoRa_RESET: TP1.1(TP) U6.3(NRESET) ; port RESET  [project net BOOT]
MISO: TP6.1(TP) U6.16(MISO_TX) ; port MISO
MOSI: TP4.1(TP) U6.17(MOSI_RX) ; port MOSI
SCK: TP3.1(TP) U6.18(SCK_RTSN) ; port SCK
NetC31_1: C31.1 C32.2 C36.2 L6.2
NetC31_2: C31.2 C35.2 L5.2 L6.1
NetC32_1: C32.1 C33.2 C37.2
NetC33_1: C33.1 J6.1
NetC34_2: C34.2 L5.1 U6.22(RFIO)
NetC38_2: C38.2 U6.1(VR_PA)
NetC39_2: C39.2 C42.2 L7.1 U6.2(VDD_IN) U6.12(DCC_FB)
NetL7_2: L7.2 U6.14(DCC_SW)
NetU6_4: U6.4(XTA) Y3.3
NetU6_6: U6.6(XTB) Y3.1

Not connected (* = marked no-connect by the designer): U6 9(DIO2)* 10(DIO3)*

### Notes on the sheet
- SX1280 used for communication (LoRa 2.4 GHz, common antennas, shorter antennas, lowest power LoRa tranceiver available); SMA antenna used
- impedance matching configurations(40R to 50R after C25)
- Values based on antenna input impedance; capacitors to ground can be left unpopullated, inductors or series capacitors can be swaped with 0R resistors or shunts
- last 2 capacitors are for impedance matching for certain antenna
- Footprint for Inductor: can be left unpopulated for lower power > best efficiency from LDO

### Library data of the parts
C31 C32 C35 C36 C38-C42 = CAP_0603: Capacitor SMD 0603; Manufacturer: *; Manufacturer Part Number: *; Distributor Link: *; LCSC: *; Rating: *; Dielectric: *
C33 C37 = CAP_0603: Capacitor SMD 0805; Manufacturer: *; Manufacturer Part Number: *; Distributor Link: *; LCSC: *; Rating: *; Dielectric: *
C34 = CAP_0805: Capacitor SMD 0805; Manufacturer: *; Manufacturer Part Number: *; Distributor Link: *; LCSC: *; Rating: *; Dielectric: *
J6 = CON-SMA-EDGE-S: as J4 on sheet 2_Microcontroller; Manufacturer Part Number: CON-SMA-EDGE-S
L5-L7 = IND_0603: Inductor SMD 0603
TP1-TP7 = TEST_POINT_RND_1MM: Test Point Round 1mm (NO BOM)
U6 = SX1280: Low power LoRa transceiver operating at 2.4GHz with ranging capability
Y3 = Crystal: Manufacturer: Epson; Manufacturer Part Number: TSX-3225 24.0000MF15X-AC

## Sheet 4_Display_NFC.SchDoc: SD Card and NFC
size A4; DrawnBy: Cristian Oprea; Revision: 1; SheetNumber: 4; SheetTotal: 4
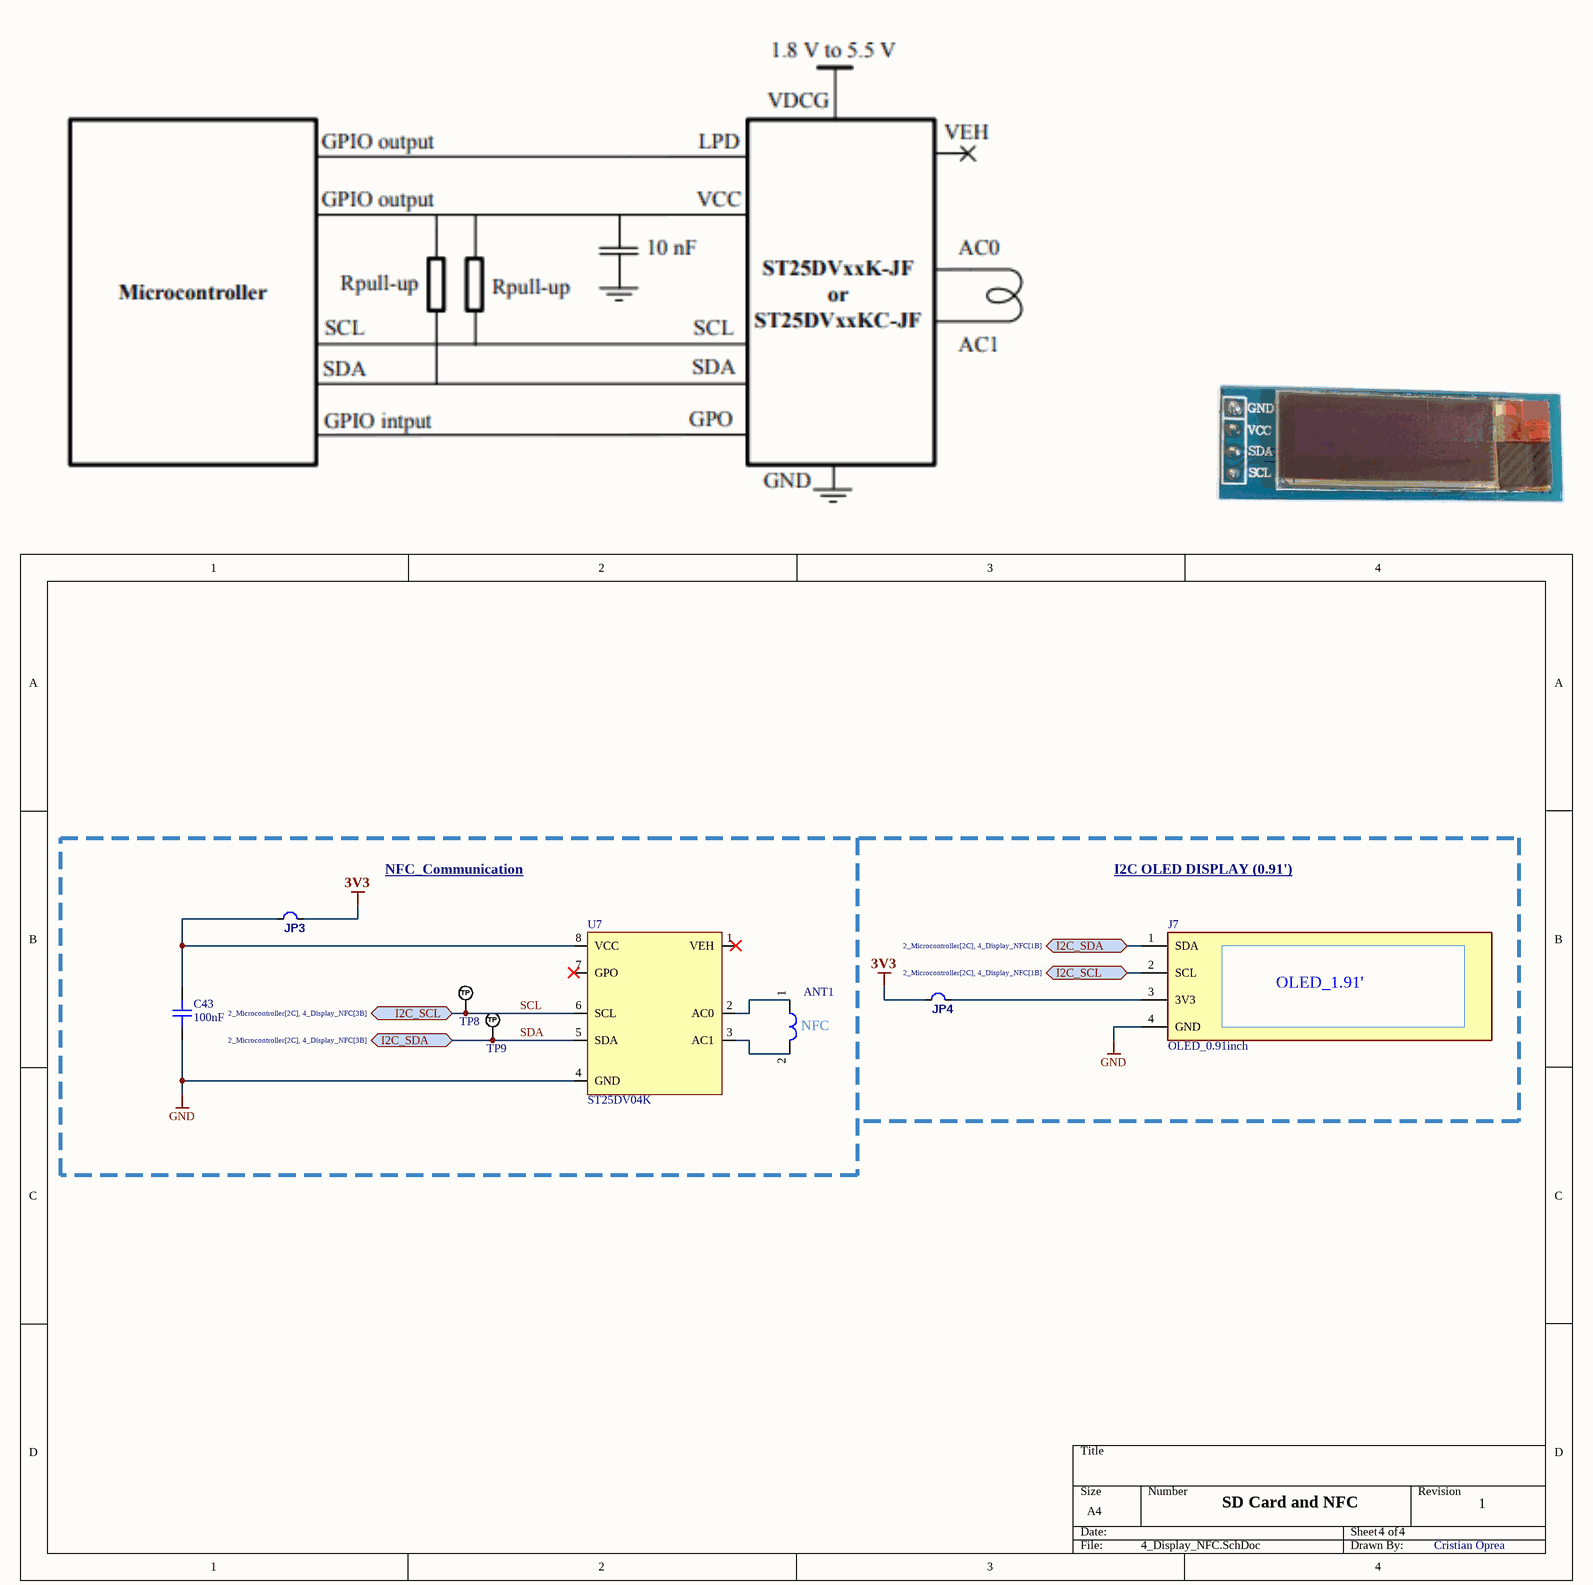
[diagram p10: 4_Display_NFC.SchDoc]

### Parts
ANT1  NFC_ANTENNA  [ANT16]  (value not drawn)
C43  100nF  [C0603]
J7  OLED_0.91inch  [OLED_0.91in]
JP3  JUMPER  [HEADER_1x2_2.54]  (value not drawn)
JP4  JUMPER  [HEADER_1x2_2.54]  (value not drawn)
TP8  TP_NOBOM  [TEST_PAD_THD]  (value not drawn)  (no BOM)
TP9  TP_NOBOM  [TEST_PAD_THD]  (value not drawn)  (no BOM)
U7  ST25DV04K  [SOIC-SN8_N]

### Ports
I2C_SCL (bidir, see 2_Microcontroller[2C], 4_Display_NFC[1B]), I2C_SCL (bidir, see 2_Microcontroller[2C], 4_Display_NFC[3B]), I2C_SDA (bidir, see 2_Microcontroller[2C], 4_Display_NFC[1B]), I2C_SDA (bidir, see 2_Microcontroller[2C], 4_Display_NFC[3B])

### Nets
3V3: JP3.2 JP4.1
GND: C43.1 J7.4(GND) U7.4(GND)
SCL: J7.2(SCL) TP8.1(TP) U7.6(SCL) ; port I2C_SCL
SDA: J7.1(SDA) TP9.1(TP) U7.5(SDA) ; port I2C_SDA
NetANT1_1: ANT1.1 U7.2(AC0)
NetANT1_2: ANT1.2 U7.3(AC1)
NetC43_2: C43.2 JP3.1 U7.8(VCC)
NetJ7_3: J7.3(3V3) JP4.2

Not connected (* = marked no-connect by the designer): U7 1(VEH)* 7(GPO)*

### Notes on the sheet
- (near JP3) VDD supplied only for debug after reset
- NFC_Communication
- (near J7) VDD supplied only for debug in field
- I2C OLED DISPLAY (0.91')
- (in symbol NFC_ANTENNA) NFC
- (in symbol OLED_0.91inch) OLED_1.91'

### Library data of the parts
C43 = CAP_0603: Capacitor SMD 0603; Manufacturer: *; Manufacturer Part Number: *; Distributor Link: *; LCSC: *; Rating: *; Dielectric: *
J7 = OLED_0.91inch: I2C OLED display (horizontal) 0.91inch
JP3 JP4 = JUMPER: *; PackageReference: *; Manufacturer Part Number 1: *
TP8 TP9 = TEST_POINT_RND_1MM: Test Point Round 1mm (NO BOM)
U7 = ST25DV04K: ST25DO4K NFC module with I2C

## Nets that join several sheets
3V3: 1_Power (JP2.2), 2_Microcontroller (15 pins), 3_Communication (C40.2 C41.2 U6.11 U6.15), 4_Display_NFC (JP3.2 JP4.1)
GND: 1_Power (20 pins), 2_Microcontroller (33 pins), 3_Communication (19 pins), 4_Display_NFC (C43.1 J7.4 U7.4)
VBUS: 1_Power (JP1.1), 2_Microcontroller (5 pins)
BOOT: 2_Microcontroller (C17.2 R10.1 SW2.1 U5.15), 3_Communication (TP1.1 U6.3)
LoRa_BUSY: 2_Microcontroller (U5.16), 3_Communication (TP5.1 U6.7)
LoRa_DIO1: 2_Microcontroller (U5.8), 3_Communication (TP7.1 U6.8)
LoRa_NSS: 2_Microcontroller (U5.9), 3_Communication (TP2.1 U6.19)
MISO: 2_Microcontroller (U5.13), 3_Communication (TP6.1 U6.16)
MOSI: 2_Microcontroller (U5.12), 3_Communication (TP4.1 U6.17)
SCK: 2_Microcontroller (U5.10), 3_Communication (TP3.1 U6.18)
SCL: 2_Microcontroller (R11.1 U5.14), 4_Display_NFC (J7.2 TP8.1 U7.6)
SDA: 2_Microcontroller (R12.1 U5.6), 4_Display_NFC (J7.1 TP9.1 U7.5)